# EasyEDA Pro project ProPrj_ArduinoUNoShield_ELE795_2026-08-09.epro

# Schematic Schematic1
Board Name: Board1; Create Date: 2026-07-07; Page Name: P1; Project Name: ArduinoUNoShield_ELE795; Schematic Name: Schematic1; Update Date: 2026-07-07; Company: EasyEDA.com; Page Size: A4; Version: V1.0
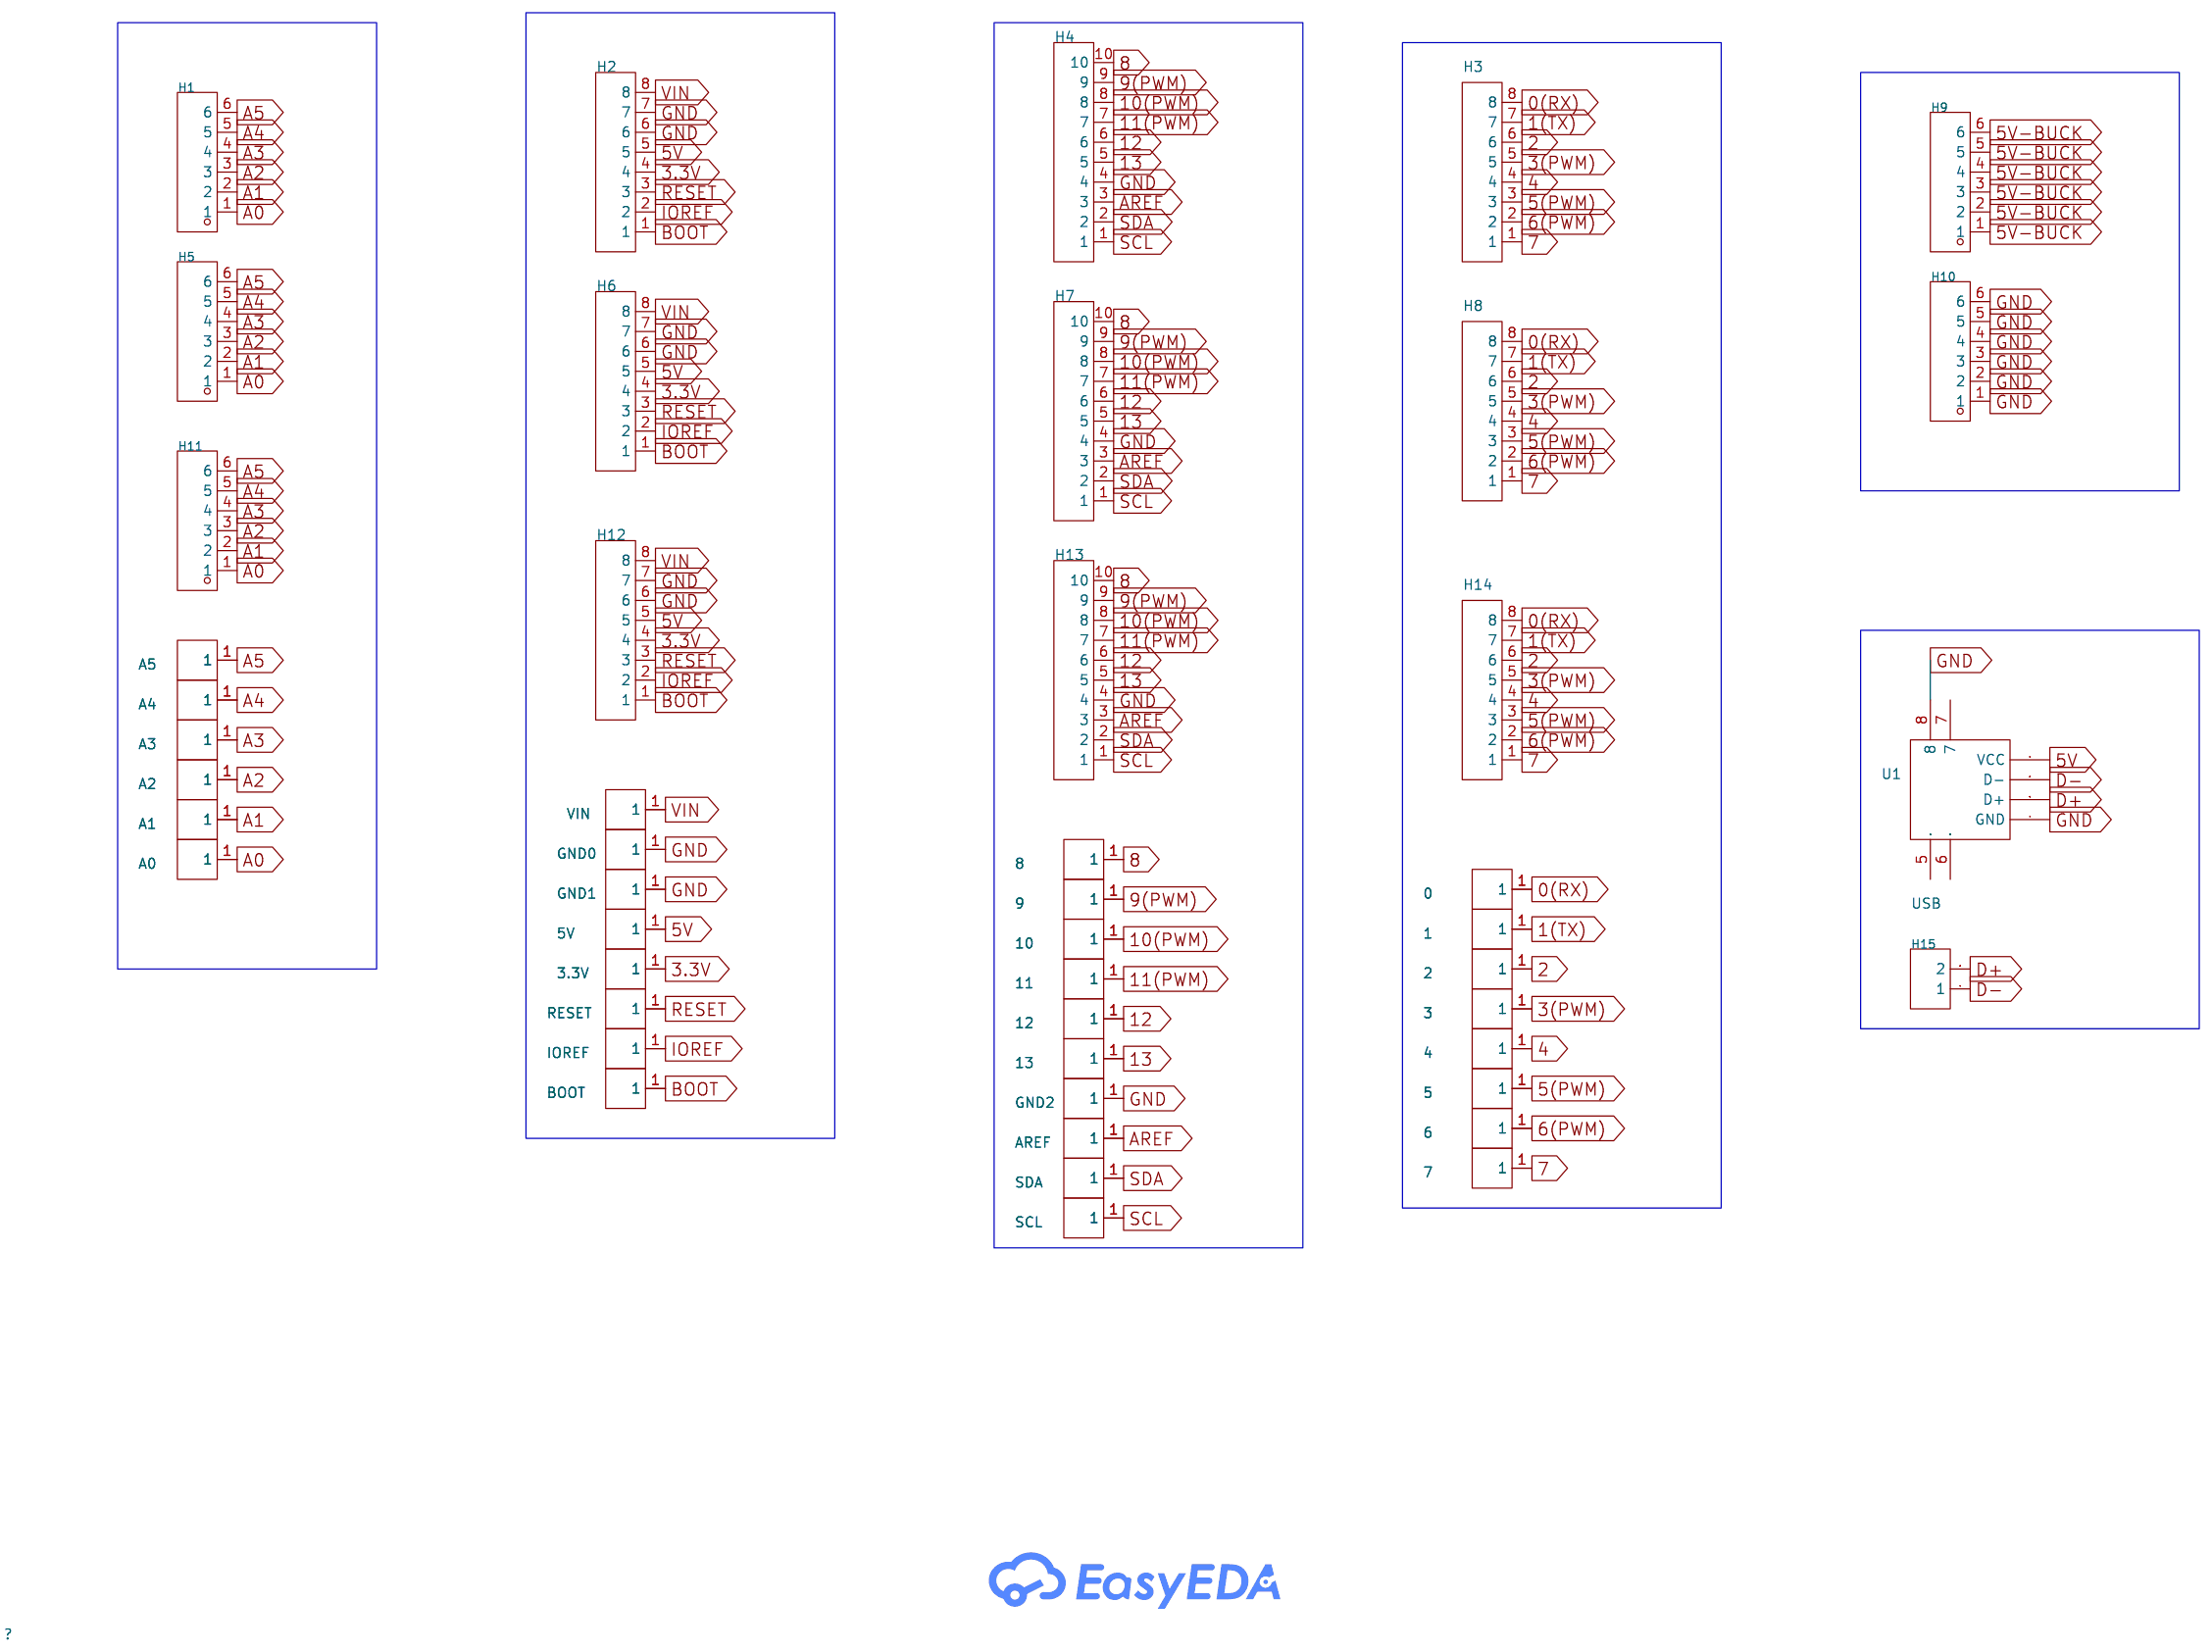
[diagram p0: schematic sheet]

## Parts
0  5017  [CONN-SMD_5017]
1  5017  [CONN-SMD_5017]
2  5017  [CONN-SMD_5017]
3  5017  [CONN-SMD_5017]
3.3V  5017  [CONN-SMD_5017]
4  5017  [CONN-SMD_5017]
5  5017  [CONN-SMD_5017]
5V  5017  [CONN-SMD_5017]
6  5017  [CONN-SMD_5017]
7  5017  [CONN-SMD_5017]
8  5017  [CONN-SMD_5017]
9  5017  [CONN-SMD_5017]
10  5017  [CONN-SMD_5017]
11  5017  [CONN-SMD_5017]
12  5017  [CONN-SMD_5017]
13  5017  [CONN-SMD_5017]
A0  5017  [CONN-SMD_5017]
A1  5017  [CONN-SMD_5017]
A2  5017  [CONN-SMD_5017]
A3  5017  [CONN-SMD_5017]
A4  5017  [CONN-SMD_5017]
A5  5017  [CONN-SMD_5017]
AREF  5017  [CONN-SMD_5017]
BOOT  5017  [CONN-SMD_5017]
GND0  5017  [CONN-SMD_5017]
GND1  5017  [CONN-SMD_5017]
GND2  5017  [CONN-SMD_5017]
H1  -  [HDR-TH_6P-P2.54-V-M-1]
H2  -  [HDR-TH_8P-P2.54-V-M]
H3  -  [HDR-TH_8P-P2.54-V-M]
H4  -  [HDR-TH_10P-P2.54-V-M-1]
H5  -  [HDR-TH_6P-P2.54-V-F]
H6  -  [HDR-TH_8P-P2.54-V-F-1]
H7  -  [HDR-TH_10P-P2.54-V-F]
H8  -  [HDR-TH_8P-P2.54-V-F-1]
H9  -  [HDR-TH_6P-P2.54-V-F]
H10  -  [HDR-TH_6P-P2.54-V-F]
H11  -  [HDR-TH_6P-P2.54-V-F]
H12  -  [HDR-TH_8P-P2.54-V-F-1]
H13  -  [HDR-TH_10P-P2.54-V-F]
H14  -  [HDR-TH_8P-P2.54-V-F-1]
H15  -  [HDR-TH_2P-P2.54-V-F]
IOREF  5017  [CONN-SMD_5017]
RESET  5017  [CONN-SMD_5017]
SCL  5017  [CONN-SMD_5017]
SDA  5017  [CONN-SMD_5017]
U1  USB  [USB-SMD_USB_1]
VIN  5017  [CONN-SMD_5017]

## Library data of the parts
0-3 3.3V 4 5 5V 6-13 A0-A5 AREF BOOT GND0-GND2 IOREF RESET SCL SDA VIN = 5017: Supplier Part: C9900015874; Supplier Footprint: Testpoint_SMD; JLCPCB Part Class: Extended Part; Supplier: LCSC
H1 = HDR-M_2.54_1x6P: Supplier Footprint: Through
H2 H3 = HDR-M_2.54_1x8P: Supplier Footprint: Through
H4 = HDR-M_2.54_1x10P: Supplier Footprint: Through
H5 H9-H11 = HDR-F_2.54_1x6P: Supplier Footprint: Through
H6 H8 H12 H14 = HDR-F_2.54_1x8P: Supplier Footprint: Through
H7 H13 = HDR-F_2.54_1x10P: Supplier Footprint: Through
H15 = HDR-F_2.54_1x2P: Supplier Footprint: Through
U1 = USB: Supplier Part: C9900237861; Supplier Footprint: SMD; Supplier: LCSC

## Nets
3.3V: 3.3V.1 H2.4 H6.4 H12.4
5V: 5V.1 H2.5 H6.5 H12.5 U1.1(VCC)
5V-BUCK: H9.1 H9.2 H9.3 H9.4 H9.5 H9.6
GND: GND0.1 GND1.1 GND2.1 H2.6 H2.7 H4.4 H6.6 H6.7 H7.4 H10.1 H10.2 H10.3 H10.4 H10.5 H10.6 H12.6 H12.7 H13.4 U1.4(GND) U1.8
VIN: H2.8 H6.8 H12.8 VIN.1
0(RX): 0.1 H3.8 H8.8 H14.8
1(TX): 1.1 H3.7 H8.7 H14.7
2: 2.1 H3.6 H8.6 H14.6
3(PWM): 3.1 H3.5 H8.5 H14.5
4: 4.1 H3.4 H8.4 H14.4
5(PWM): 5.1 H3.3 H8.3 H14.3
6(PWM): 6.1 H3.2 H8.2 H14.2
7: 7.1 H3.1 H8.1 H14.1
8: 8.1 H4.10 H7.10 H13.10
9(PWM): 9.1 H4.9 H7.9 H13.9
10(PWM): 10.1 H4.8 H7.8 H13.8
11(PWM): 11.1 H4.7 H7.7 H13.7
12: 12.1 H4.6 H7.6 H13.6
13: 13.1 H4.5 H7.5 H13.5
A0: A0.1 H1.1 H5.1 H11.1
A1: A1.1 H1.2 H5.2 H11.2
A2: A2.1 H1.3 H5.3 H11.3
A3: A3.1 H1.4 H5.4 H11.4
A4: A4.1 H1.5 H5.5 H11.5
A5: A5.1 H1.6 H5.6 H11.6
AREF: AREF.1 H4.3 H7.3 H13.3
BOOT: BOOT.1 H2.1 H6.1 H12.1
D+: H15.2 U1.3(D+)
D-: H15.1 U1.2(D-)
IOREF: H2.2 H6.2 H12.2 IOREF.1
RESET: H2.3 H6.3 H12.3 RESET.1
SCL: H4.1 H7.1 H13.1 SCL.1
SDA: H4.2 H7.2 H13.2 SDA.1

Not connected (* = marked no-connect by the designer): U1 5(SH1) 6(SH2) 7

# Board PCB1
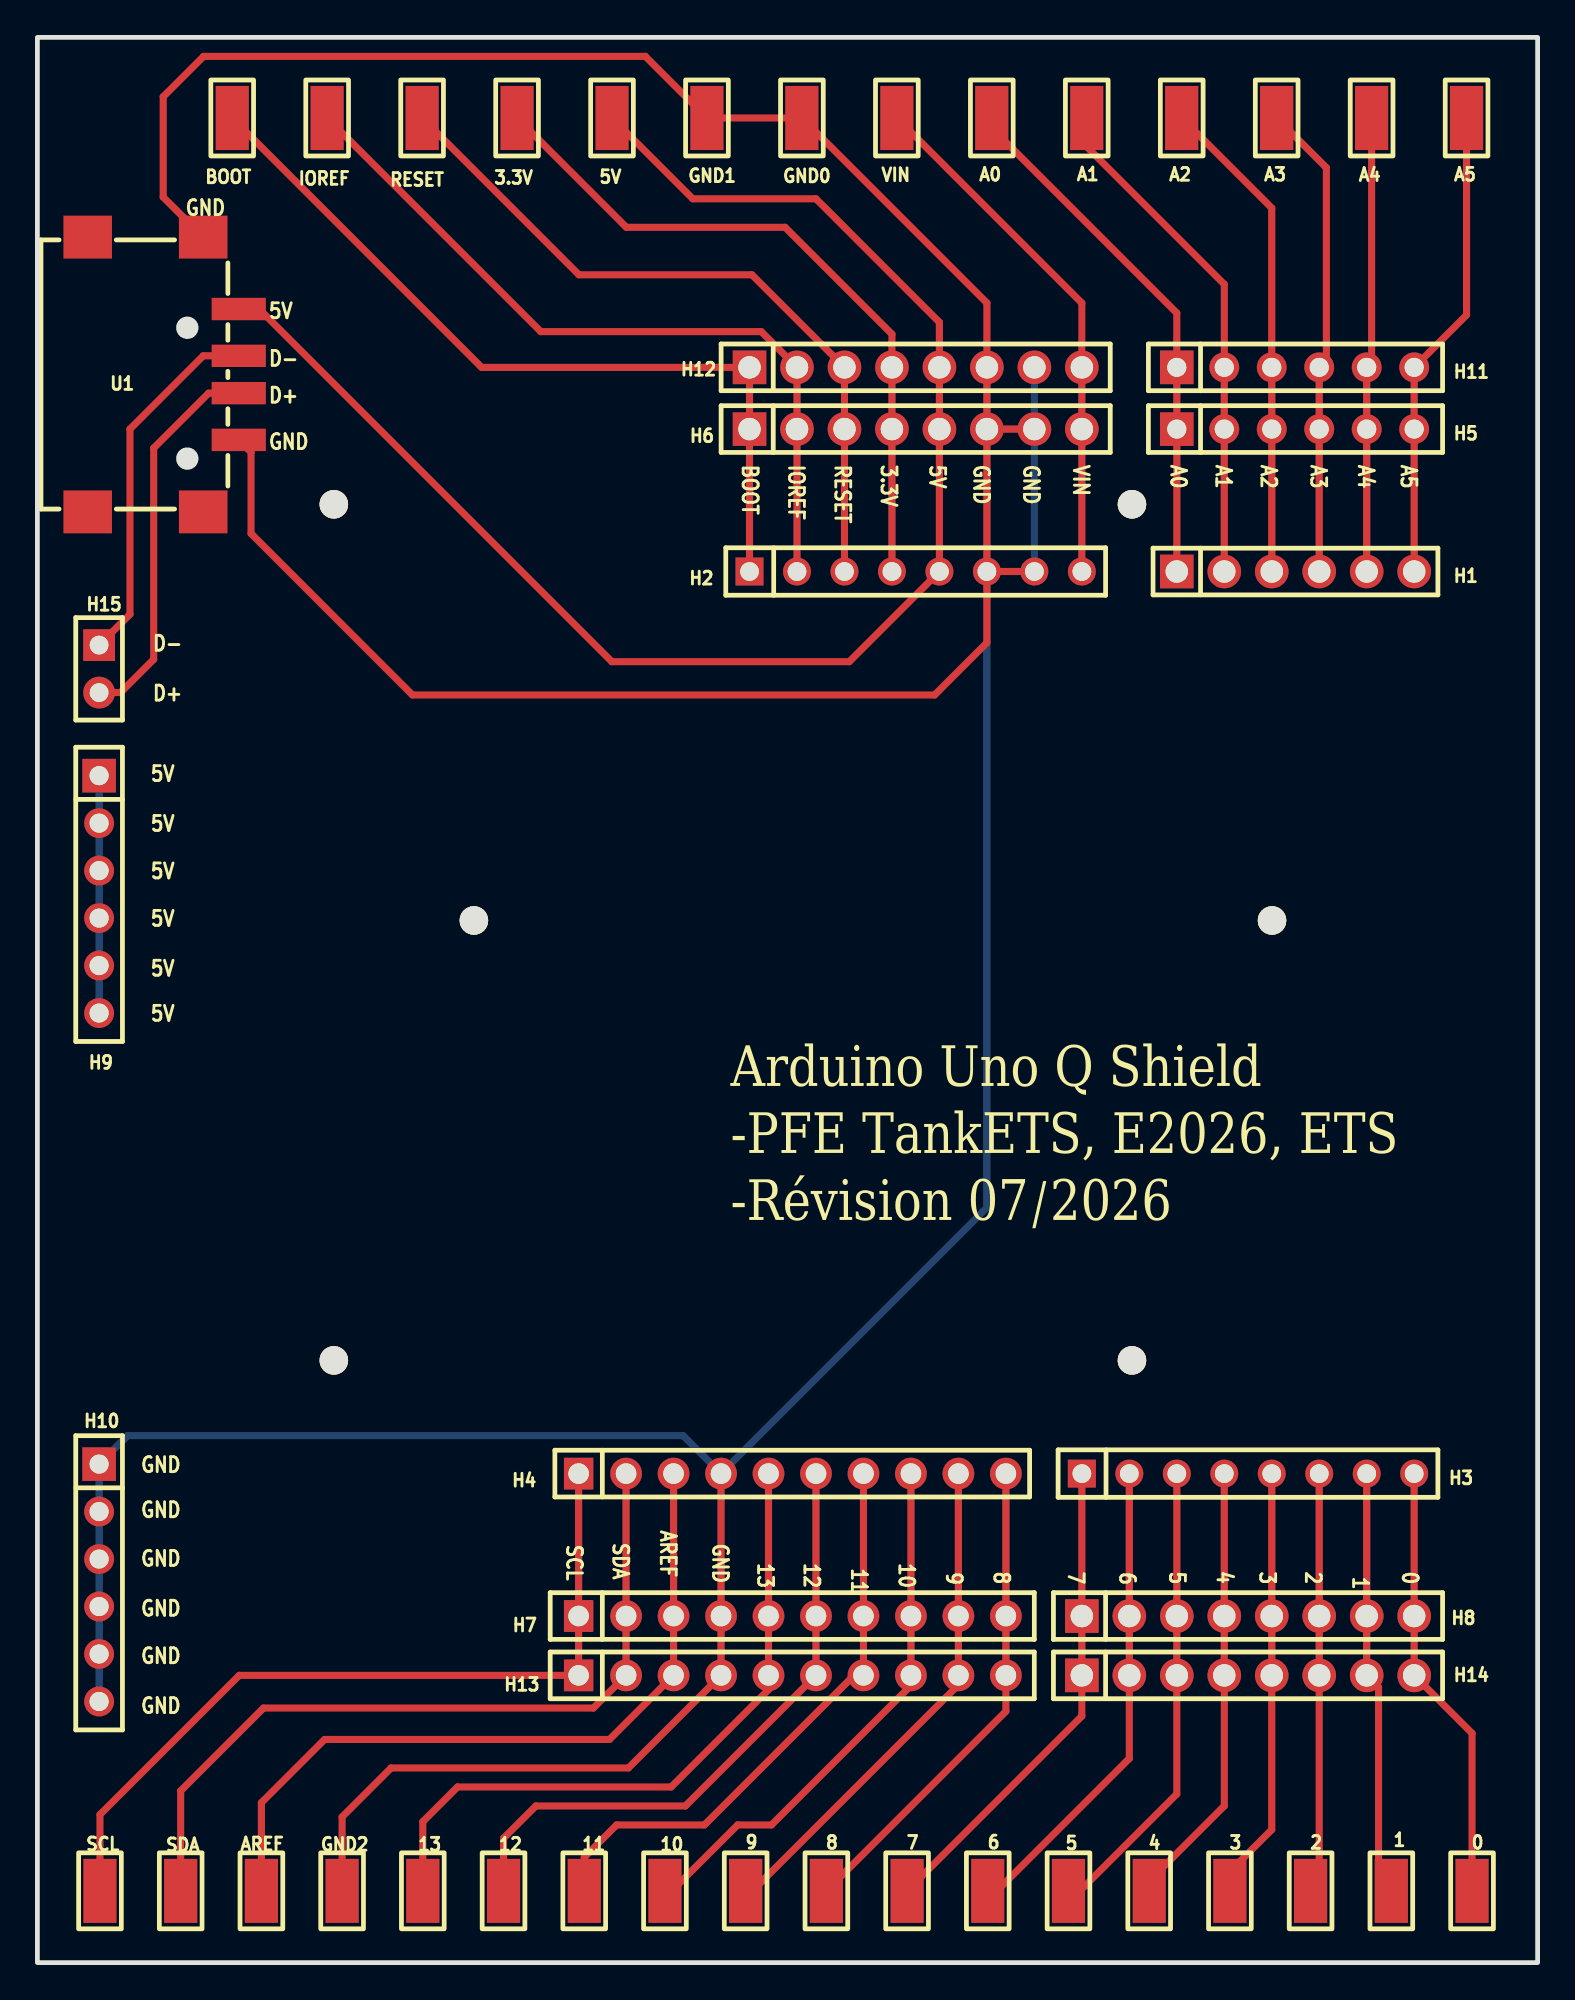
[diagram p1: board, top side]
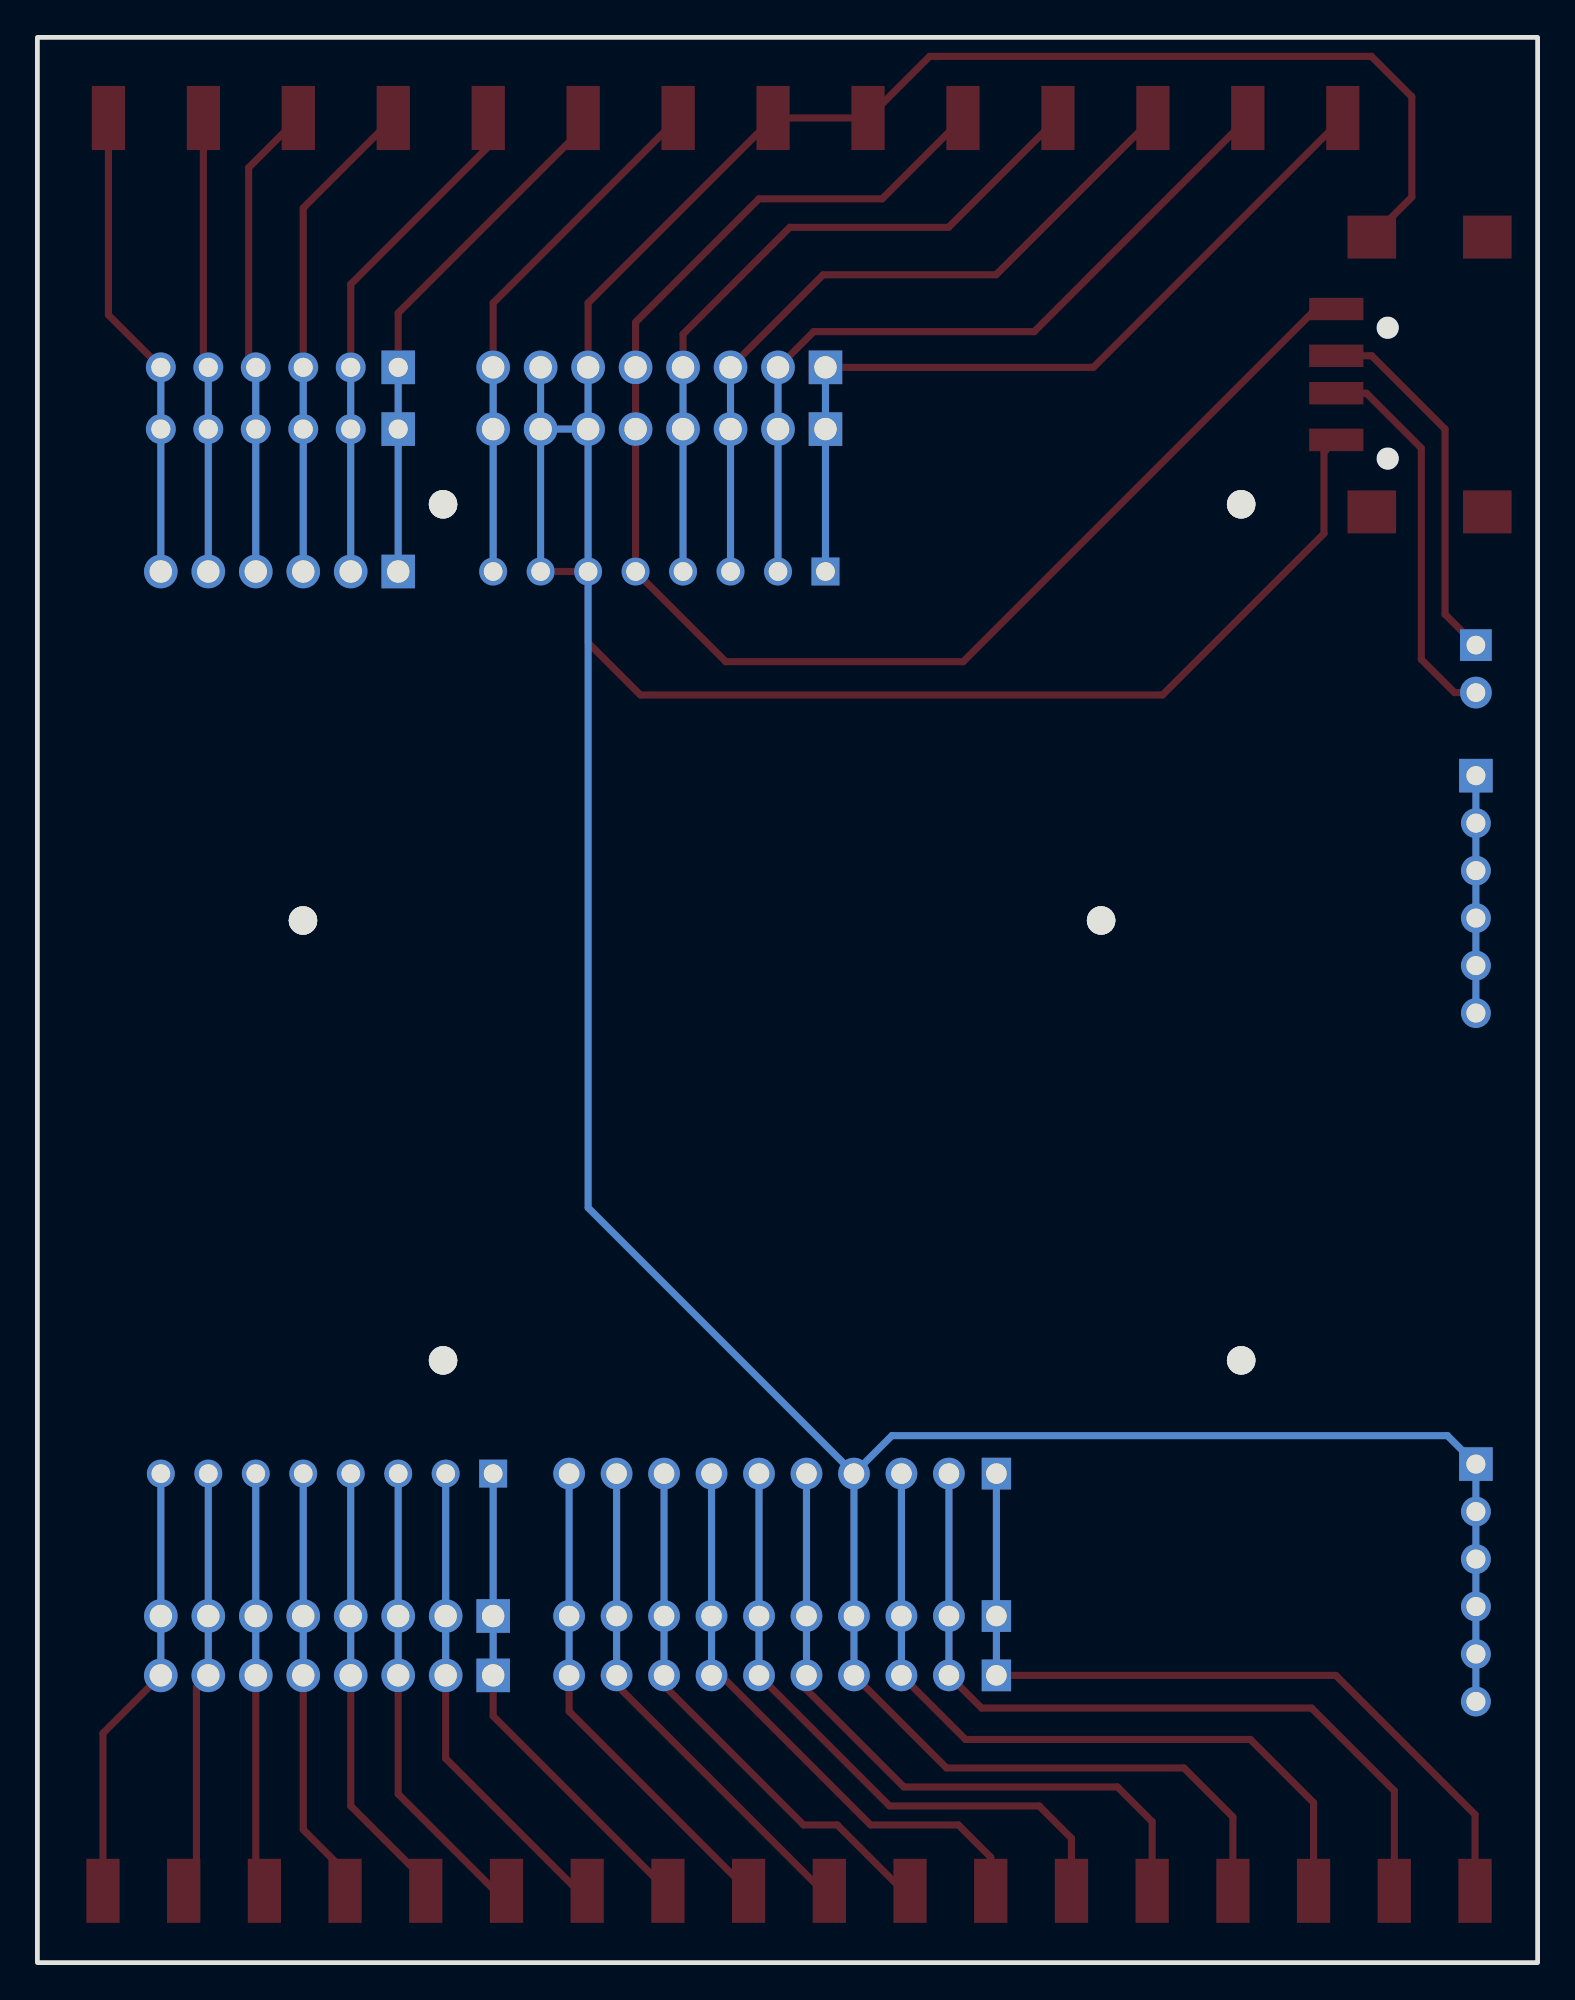
[diagram p2: board, bottom side, seen from below]

Outline 80.26 x 103 mm; copper layers: Top Layer, Bottom Layer. Coordinates in mm from the lower left corner of the outline.
Outline path: rectangle 0,103 80.26,0
Stack: Top Layer 0.035mm / Dielectric1 1.51mm FR4 er 4.5 / Bottom Layer 0.035mm

## Design rules (mm)
template: Custom Config
spacing copperThickness1oz (default): track to track 0.254, other pairs 0.152 to 0.3
spacing copperThickness2oz: track to track 0.203, other pairs 0.152 to 0.3
track width copperThickness1oz (default): min 0.203, default 0.381, max 2.54
track width copperThickness2oz: min 0.203, default 0.254, max 2.54
differential pair differentialPair (default): width min 0.127, default 0.254, max 2.54; gap min 0.152, default 0.152
via viaSize (default): diameter min 0.889, default 0.914, max 10; hole min 0.61, default 0.635, max 6.3

## Placement (name value [footprint] x y rotation side)
0  5017  [CONN-SMD_5017]  76.76 3.84 270 top
1  5017  [CONN-SMD_5017]  72.44 3.84 270 top
2  5017  [CONN-SMD_5017]  68.12 3.84 270 top
3  5017  [CONN-SMD_5017]  63.8 3.84 270 top
3.3V  5017  [CONN-SMD_5017]  25.66 98.69 270 top
4  5017  [CONN-SMD_5017]  59.48 3.84 270 top
5  5017  [CONN-SMD_5017]  55.17 3.84 270 top
5V  5017  [CONN-SMD_5017]  30.74 98.69 270 top
6  5017  [CONN-SMD_5017]  50.85 3.84 270 top
7  5017  [CONN-SMD_5017]  46.53 3.84 270 top
8  5017  [CONN-SMD_5017]  42.21 3.84 270 top
9  5017  [CONN-SMD_5017]  37.89 3.84 270 top
10  5017  [CONN-SMD_5017]  33.58 3.84 270 top
11  5017  [CONN-SMD_5017]  29.26 3.84 270 top
12  5017  [CONN-SMD_5017]  24.94 3.84 270 top
13  5017  [CONN-SMD_5017]  20.62 3.84 270 top
A0  5017  [CONN-SMD_5017]  51.06 98.69 270 top
A1  5017  [CONN-SMD_5017]  56.14 98.69 270 top
A2  5017  [CONN-SMD_5017]  61.22 98.69 270 top
A3  5017  [CONN-SMD_5017]  66.3 98.69 270 top
A4  5017  [CONN-SMD_5017]  71.38 98.69 270 top
A5  5017  [CONN-SMD_5017]  76.46 98.69 270 top
AREF  5017  [CONN-SMD_5017]  11.99 3.84 270 top
BOOT  5017  [CONN-SMD_5017]  10.42 98.69 270 top
GND0  5017  [CONN-SMD_5017]  40.9 98.69 270 top
GND1  5017  [CONN-SMD_5017]  35.82 98.69 270 top
GND2  5017  [CONN-SMD_5017]  16.3 3.84 270 top
H1  -  [HDR-TH_6P-P2.54-V-M-1]  67.31 74.42 0 top
H2  -  [HDR-TH_8P-P2.54-V-M]  46.99 74.42 0 top
H3  -  [HDR-TH_8P-P2.54-V-M]  64.77 26.16 0 top
H4  -  [HDR-TH_10P-P2.54-V-M-1]  40.39 26.16 0 top
H5  -  [HDR-TH_6P-P2.54-V-F]  67.31 82.04 0 top
H6  -  [HDR-TH_8P-P2.54-V-F-1]  46.99 82.04 0 top
H7  -  [HDR-TH_10P-P2.54-V-F]  40.39 18.54 0 top
H8  -  [HDR-TH_8P-P2.54-V-F-1]  64.77 18.54 0 top
H9  -  [HDR-TH_6P-P2.54-V-F]  3.3 57.15 270 top
H10  -  [HDR-TH_6P-P2.54-V-F]  3.3 20.32 270 top
H11  -  [HDR-TH_6P-P2.54-V-F]  67.31 85.34 0 top
H12  -  [HDR-TH_8P-P2.54-V-F-1]  46.99 85.34 0 top
H13  -  [HDR-TH_10P-P2.54-V-F]  40.39 15.37 0 top
H14  -  [HDR-TH_8P-P2.54-V-F-1]  64.77 15.37 0 top
H15  -  [HDR-TH_2P-P2.54-V-F]  3.3 69.22 270 top
IOREF  5017  [CONN-SMD_5017]  15.5 98.69 270 top
NOREF  -  [Pad_e52]  15.86 32.22 90 top
NOREF#2  -  [Pad_e56]  58.56 78.02 90 top
NOREF#3  -  [Pad_e54]  15.86 78.02 90 top
NOREF#4  -  [Pad_e55]  58.56 32.22 90 top
NOREF#5  -  [Pad_e3341]  66.05 55.75 90 top
NOREF#6  -  [Pad_e3342]  23.35 55.75 90 top
RESET  5017  [CONN-SMD_5017]  20.58 98.69 270 top
SCL  5017  [CONN-SMD_5017]  3.35 3.84 270 top
SDA  5017  [CONN-SMD_5017]  7.67 3.84 270 top
U1  USB  [USB-SMD_USB_1]  6.73 84.96 270 top
VIN  5017  [CONN-SMD_5017]  45.98 98.69 270 top

## Footprints (pads in the part's own frame, mm; a bottom-side part is the same pattern mirrored in y, then rotated)
CONN-SMD_5017
  rect 3.43x1.78 smd: 1(0,0)
HDR-TH_2P-P2.54-V-F
  rect 1.7x1.7 hole 1: 1(-1.27,0)
  round 1.7 hole 1: 2(1.27,0)
HDR-TH_6P-P2.54-V-F
  rect 1.8x1.8 hole 1.02: 1(-6.35,0)
  round 1.6 hole 1.02: 2(-3.81,0) 3(-1.27,0) 4(1.27,0) 5(3.81,0) 6(6.35,0)
HDR-TH_6P-P2.54-V-M-1
  rect 1.8x1.8 hole 1.2: 1(-6.35,0)
  round 1.8 hole 1.2: 2(-3.81,0) 3(-1.27,0) 4(1.27,0) 5(3.81,0) 6(6.35,0)
HDR-TH_8P-P2.54-V-F-1
  rect 1.8x1.8 hole 1.2: 1(-8.89,0)
  round 1.8 hole 1.2: 2(-6.35,0) 3(-3.81,0) 4(-1.27,0) 5(1.27,0) 6(3.81,0) 7(6.35,0) 8(8.89,0)
HDR-TH_8P-P2.54-V-M
  rect 1.5x1.5 hole 1: 1(-8.89,0)
  round 1.5 hole 1: 2(-6.35,0) 3(-3.81,0) 4(-1.27,0) 5(1.27,0) 6(3.81,0) 7(6.35,0) 8(8.89,0)
HDR-TH_10P-P2.54-V-F
  rect 1.575x1.7 hole 1.1: 1(-11.43,0)
  round 1.7 hole 1.1: 2(-8.89,0) 3(-6.35,0) 4(-3.81,0) 5(-1.27,0) 6(1.27,0) 7(3.81,0) 8(6.35,0) 9(8.89,0) 10(11.43,0)
HDR-TH_10P-P2.54-V-M-1
  rect 1.575x1.7 hole 1.1: 1(-11.43,0)
  round 1.7 hole 1.1: 2(-8.89,0) 3(-6.35,0) 4(-3.81,0) 5(-1.27,0) 6(1.27,0) 7(3.81,0) 8(6.35,0) 9(8.89,0) 10(11.43,0)
Pad_e52
  round 1.524 hole 3.2: 1(0,0)
Pad_e54
  round 1.524 hole 3.2: 1(0,0)
Pad_e55
  round 1.524 hole 3.2: 1(0,0)
Pad_e56
  round 1.524 hole 3.2: 1(0,0)
Pad_e3341
  round 1.524 hole 3.2: 1(0,0)
Pad_e3342
  round 1.524 hole 3.2: 1(0,0)
USB-SMD_USB_1
  rect 1.2x2.9 smd: 1(-3.5,4.04) 2(-1,4.04) 3(1,4.04) 4(3.5,4.04)
  rect 2.3x2.6 smd: 5(7.35,2.14) 6(7.35,-4.04) 7(-7.35,-4.04) 8(-7.35,2.14)

## Nets
As in the schematic.

Pads without a net: NOREF 1; NOREF#2 1; NOREF#3 1; NOREF#4 1; NOREF#5 1; NOREF#6 1; U1 5 6 7

## Routing (per net, layer and track width the routed paths; a pad name or vN(x,y) marks a point on that pad's centre or on a via; arc(x,y) is an arc through that point)
3.3V: length 48.5
  Top Layer w0.381: H2.4 H6.4 H12.4 45.72,87.12 40,92.84 31.51,92.84 3.3V.1
  Bottom Layer w0.381: H12.4 H6.4 H2.4
5V: length 82.7
  Top Layer w0.381: U1.1 11.87,88.46 30.73,69.6 43.43,69.6 H2.5 H6.5 H12.5 48.26,87.76 41.66,94.36 35.07,94.36 5V.1
5V-BUCK: length 12.7
  Bottom Layer w0.381: H9.6 H9.5 H9.4 H9.3 H9.2 H9.1
GND: length 306.4
  Top Layer w0.381: U1.8 6.73,94.45 6.73,99.82 8.89,101.98 32.53,101.98 GND1.1 GND0.1 50.8,88.79 H12.6 H6.6 ; H6.6 H2.6 ; H6.6 H6.7 ; GND2.1 16.3,7.79 18.92,10.41 31.62,10.41 H13.4 H7.4 H4.4 ; U1.4 11.43,80.8 11.43,76.45 20.07,67.82 48.01,67.82 50.8,70.61 H2.6 ; H2.6 H2.7
  Bottom Layer w0.381: H6.6 H6.7 ; H6.6 H12.6 ; H6.6 H2.6 50.8,40.39 H4.4 ; H6.7 H12.7 ; H6.7 H2.7 ; H10.6 H10.5 H10.4 H10.2 H10.1 4.83,28.19 34.54,28.19 H4.4 ; H4.4 H7.4 H13.4
VIN: length 39.3
  Top Layer w0.381: H2.8 H6.8 H12.8 55.88,88.79 VIN.1
  Bottom Layer w0.381: H2.8 H6.8 H12.8
0(RX): length 34.4
  Top Layer w0.381: H3.8 H8.8 H14.8 76.76,12.27 0.1
  Bottom Layer w0.381: H14.8 H8.8 H3.8
1(TX): length 33.7
  Top Layer w0.381: H3.7 H8.7 H14.7 71.75,14.73 71.75,4.52 1.1
  Bottom Layer w0.381: H3.7 H8.7 H14.7
2: length 33.3
  Top Layer w0.381: H3.6 H8.6 H14.6 68.58,4.3 2.1
  Bottom Layer w0.381: H3.6 H8.6 H14.6
3(PWM): length 34
  Top Layer w0.381: 3.1 63.8,4.87 66.04,7.11 H14.5 H8.5 H3.5
  Bottom Layer w0.381: H14.5 H8.5 H3.5
4: length 34.8
  Top Layer w0.381: 4.1 59.48,4.37 63.5,8.38 H14.4 H8.4 H3.4
  Bottom Layer w0.381: H14.4 H8.4 H3.4
5(PWM): length 35.9
  Top Layer w0.381: 5.1 55.78,3.84 60.96,9.02 H14.3 H8.3 H3.3
  Bottom Layer w0.381: H3.3 H8.3 H14.3
6(PWM): length 36.5
  Top Layer w0.381: H3.2 H8.2 H14.2 58.42,10.92 51.34,3.84 6.1
  Bottom Layer w0.381: H14.2 H8.2 H3.2
7: length 37
  Top Layer w0.381: 7.1 55.88,13.19 H14.1 H8.1 H3.1
  Bottom Layer w0.381: H3.1 H8.1 H14.1
8: length 37.1
  Top Layer w0.381: H4.10 H7.10 H13.10 51.82,13.44 8.1
  Bottom Layer w0.381: H13.10 H7.10 H4.10
9(PWM): length 38
  Top Layer w0.381: 9.1 38.26,3.84 49.28,14.86 H13.9 H7.9 H4.9
  Bottom Layer w0.381: H13.9 H7.9 H4.9
10(PWM): length 39.8
  Top Layer w0.381: 10.1 33.94,3.84 37.47,7.37 39.27,7.37 46.74,14.83 H13.8 H7.8 H4.8
  Bottom Layer w0.381: H13.8 H7.8 H4.8
11(PWM): length 42.4
  Top Layer w0.381: H4.7 H7.7 H13.7 43.69,15.37 35.69,7.37 30.99,7.37 29.26,5.64 11.1
  Bottom Layer w0.381: H4.7 H7.7 H13.7
12: length 44.7
  Top Layer w0.381: H4.6 H7.6 H13.6 34.67,8.38 26.67,8.38 24.94,6.65 12.1
  Bottom Layer w0.381: H4.6 H7.6 H13.6
13: length 47.5
  Top Layer w0.381: H4.5 H7.5 H13.5 39.12,14.61 33.91,9.4 22.48,9.4 20.62,7.54 13.1
  Bottom Layer w0.381: H4.5 H7.5 H13.5
A0: length 39.3
  Top Layer w0.381: A0.1 51.06,98.15 60.96,88.25 H11.1 H5.1 H1.1
  Bottom Layer w0.381: H1.1 H5.1 H11.1
A1: length 38.2
  Top Layer w0.381: A1.1 56.14,97.15 63.5,89.79 H11.2 H5.2 H1.2
  Bottom Layer w0.381: H1.2 H5.2 H11.2
A2: length 37.2
  Top Layer w0.381: H1.3 H5.3 H11.3 66.04,93.87 A2.1
  Bottom Layer w0.381: H11.3 H5.3 H1.3
A3: length 36.4
  Top Layer w0.381: A3.1 68.96,96.03 68.96,85.73 H11.4 H5.4 H1.4
  Bottom Layer w0.381: H11.4 H5.4 H1.4
A4: length 35.3
  Top Layer w0.381: A4.1 71.38,85.61 H11.5 H5.5 H1.5
  Bottom Layer w0.381: H11.5 H5.5 H1.5
A5: length 36.3
  Top Layer w0.381: A5.1 76.46,88.15 H11.6 H5.6 H1.6
  Bottom Layer w0.381: H11.6 H5.6 H1.6
AREF: length 51.2
  Top Layer w0.381: H4.3 H7.3 H13.3 30.61,11.94 15.37,11.94 11.99,8.56 AREF.1
  Bottom Layer w0.381: H13.3 H7.3 H4.3
BOOT: length 55
  Top Layer w0.381: BOOT.1 23.76,85.34 H12.1 H6.1 H2.1
  Bottom Layer w0.381: H12.1 H6.1 H2.1
D+: length 20.7
  Top Layer w0.381: U1.3 9.16,83.96 6.22,81.03 6.22,69.72 4.44,67.95 H15.2
D-: length 19.7
  Top Layer w0.381: H15.1 4.95,72.14 4.95,82.04 8.87,85.96 U1.2
IOREF: length 52.5
  Top Layer w0.381: IOREF.1 26.93,87.26 38.73,87.26 H12.2 H6.2 H2.2
  Bottom Layer w0.381: H12.2 H6.2 H2.2
RESET: length 50
  Top Layer w0.381: H2.3 H6.3 H12.3 38.23,90.3 28.97,90.3 RESET.1
  Bottom Layer w0.381: H2.3 H6.3 H12.3
SCL: length 54.4
  Top Layer w0.381: SCL.1 3.35,7.92 10.8,15.37 H13.1 H7.1 H4.1
  Bottom Layer w0.381: H4.1 H7.1 H13.1
SDA: length 53.3
  Top Layer w0.381: SDA.1 7.67,9.19 12.09,13.62 29.75,13.62 H13.2 H7.2 H4.2
  Bottom Layer w0.381: H4.2 H7.2 H13.2

## Text on the board
Top Silkscreen Layer: GND | 5V | SDA | AREF | BOOT | 13 | IOREF | 12 | RESET | 11 | 3.3V | 10 | 9 | 7 | VIN | 6 | 5 | A0 | A1 | 4 | 3 | A2 | 2 | A3 | 1 | A4 | A5 | 0 | SCL | 8 | D- | D+ | Arduino Uno Q Shield / -PFE TankETS, E2026, ETS / -Révision 07/2026
